# EAGLE design FTDI44 (EAGLE 8.0.2)
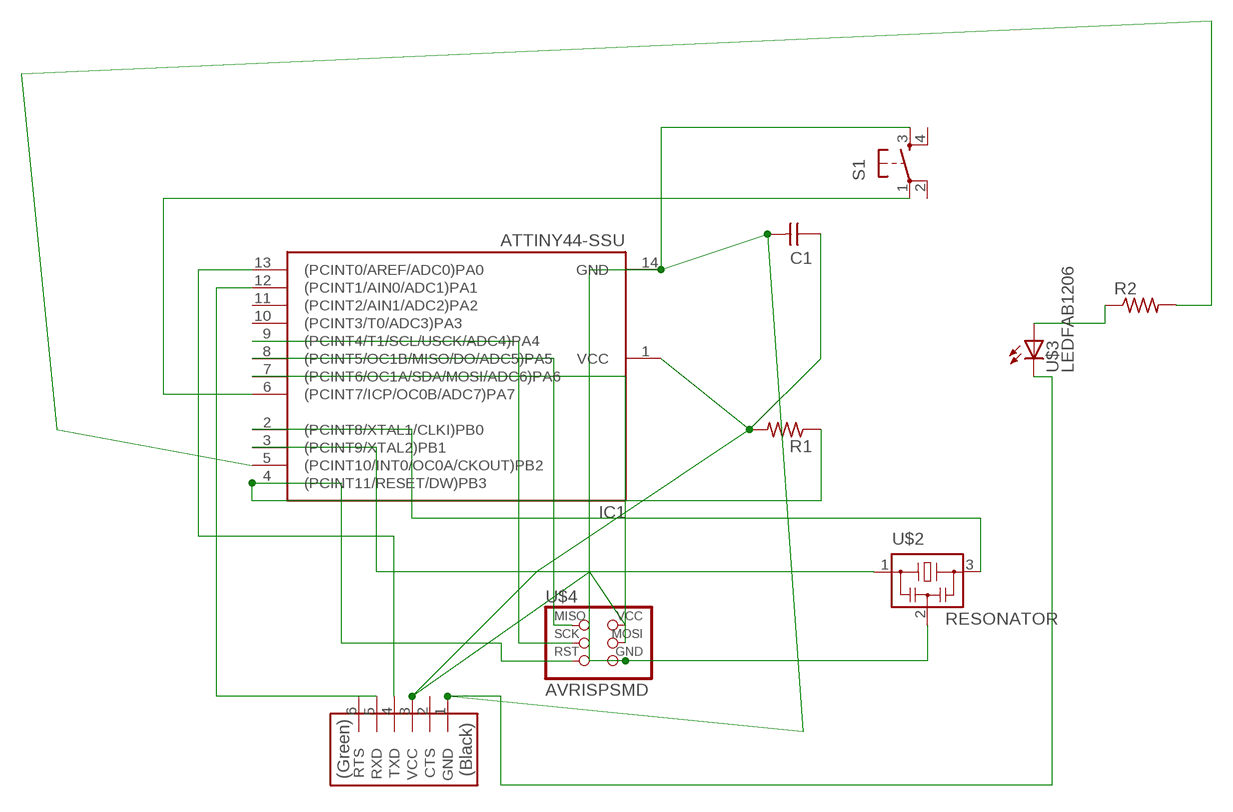
[diagram p0: schematic, sheet 1]

## Parts
C1  CAP-UNPOLARIZEDFAB  [C1206FAB]
IC1  ATTINY44-SSU  [SOIC14]
R1  RES-US1206FAB  [R1206FAB]
R2  RES-US1206FAB  [R1206FAB]
S1  6MM_SWITCH6MM_SWITCH  [6MM_SWITCH]
U$1  FTDI-SMD-HEADER  [1X06SMD]
U$2  RESONATOR  [EFOBM]
U$3  LEDFAB1206  [LED1206FAB]
U$4  AVRISPSMD  [2X03SMD]

## Nets
N$1: IC1.12((PCINT1/AIN0/ADC1)PA1) U$1.5(RXD)
N$2: C1.1 IC1.1(VCC) R1.2 U$1.3(VCC) U$4.2(VCC)
N$3: IC1.4((PCINT11/RESET/DW)PB3) R1.1 U$4.5(RST)
N$4: IC1.3((PCINT9/XTAL2)PB1) U$2.1
N$5: IC1.2((PCINT8/XTAL1/CLKI)PB0) U$2.3
N$6: C1.2 IC1.14(GND) S1.3(S) U$1.1(GND) U$2.2 U$3.2(C) U$4.6(GND)
N$7: IC1.13((PCINT0/AREF/ADC0)PA0) U$1.4(TXD)
N$8: IC1.8((PCINT5/OC1B/MISO/DO/ADC5)PA5) U$4.1(MISO)
N$9: IC1.7((PCINT6/OC1A/SDA/MOSI/ADC6)PA6) U$4.4(MOSI)
N$10: IC1.9((PCINT4/T1/SCL/USCK/ADC4)PA4) U$4.3(SCK)
N$11: R2.1 U$3.1(A)
N$12: IC1.6((PCINT7/ICP/OC0B/ADC7)PA7) S1.1(P)
N$13: IC1.5((PCINT10/INT0/OC0A/CKOUT)PB2) R2.2
Unconnected: IC1.10((PCINT3/T0/ADC3)PA3) IC1.11((PCINT2/AIN1/ADC2)PA2) S1.2(P1) S1.4(S1) U$1.2(CTS) U$1.6(RTS)

## Library data of the parts
C1 = fab:CAP-UNPOLARIZED
IC1 = fab:ATTINY44
R1 = fab:RES-US: Resistor (US Symbol) Variants with postfix FAB are widened to allow the routing of internal traces
R2 = 01_fab:RES-US: Resistor (US Symbol) Variants with postfix FAB are widened to allow the routing of internal traces
S1 = fab:6MM_SWITCH: OMRON SWITCH
U$1 = fab:FTDI-SMD-HEADER
U$2 = fab:RESONATOR
U$3 = fab:LED: LED
U$4 = fab:AVRISP

## Board
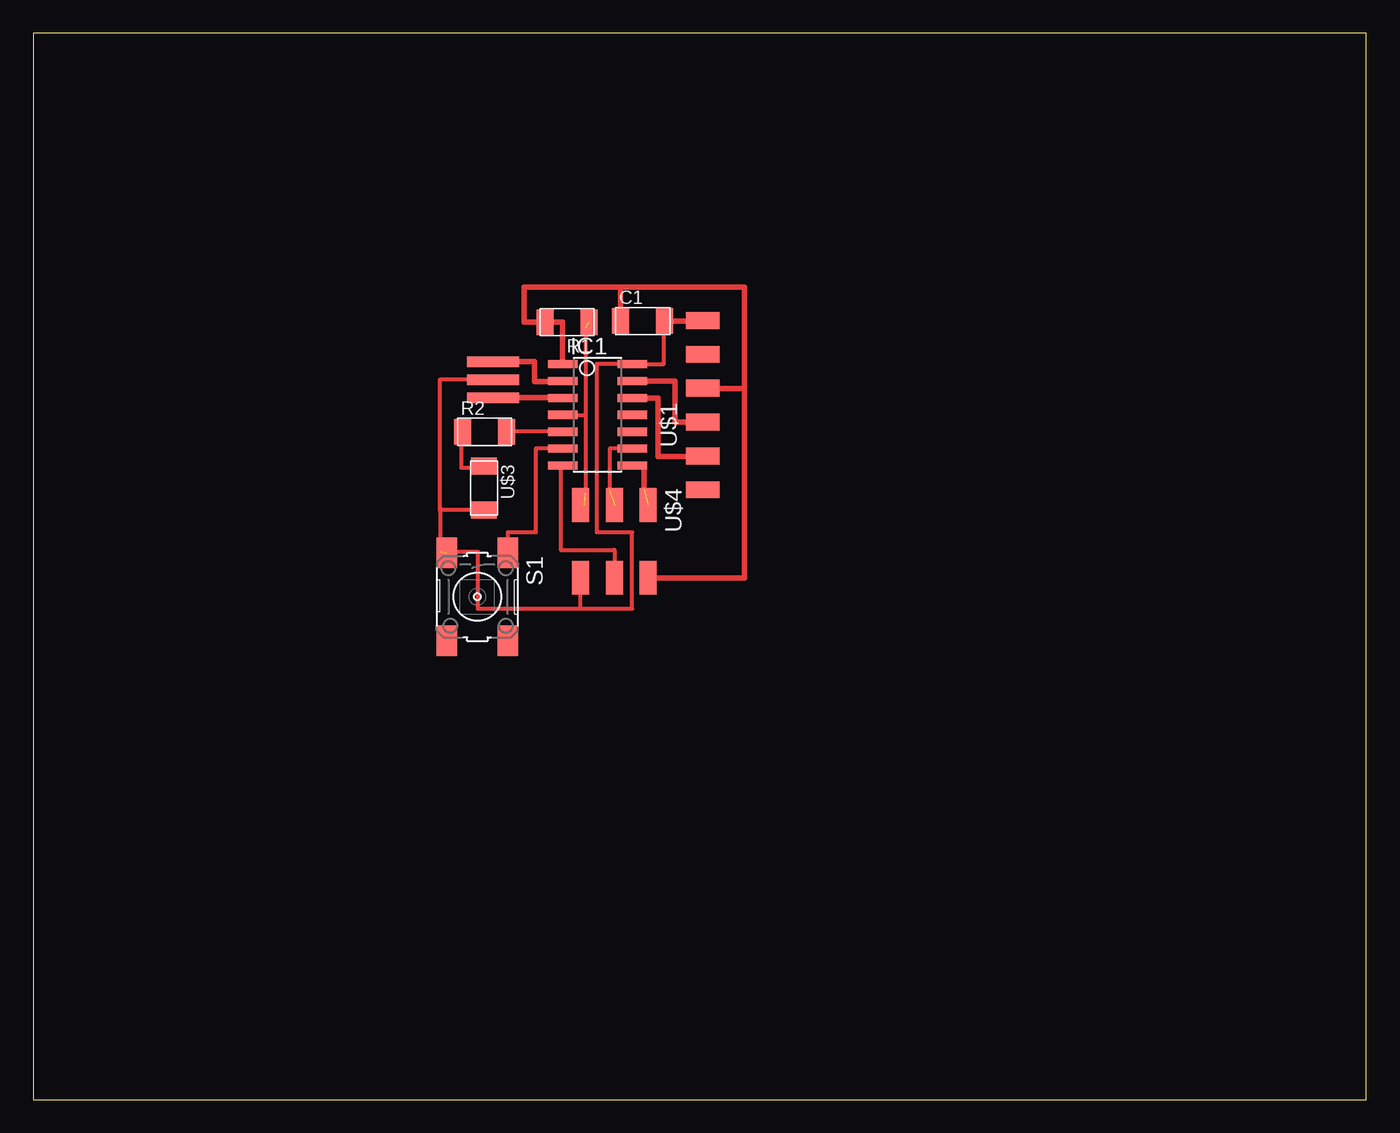
[diagram p1: board, top side]

Size 100 x 80 mm. Coordinates in mm from the lower left corner, seen from the top.
Outline: 0,0 100,0 100,80 0,80 0,0
Copper layers (1*16): Top 0.035mm / dielectric 1.5mm / Bottom 0.035mm
Design rules "default *": minimum track width 12mil, minimum drill 24mil, track to track 16mil, track to pad 16mil, pad to pad 16mil, via to via 16mil, smd to smd 16mil, copper to edge 40mil, drill to drill 8mil, minimum pad ring 10mil, minimum via ring 8mil, stop-mask expansion 4mil, vias tented up to drill 0mil, thermal gap 10mil

### Footprints (pad centres in the part's own frame; a part is rotated, then mirrored left to right if it is on the bottom)
C1206FAB = smd 1.27 x 1.905: 1 -1.651,0; 2 1.651,0
SOIC14 = smd 0.61 x 2.21: 1 -3.81,-2.603; 2 -2.54,-2.603; 3 -1.27,-2.603; 4 0,-2.603; 5 1.27,-2.603; 6 2.54,-2.603; 7 3.81,-2.603; 8 3.81,2.603; 9 2.54,2.603; 10 1.27,2.603; 11 0,2.603; 12 -1.27,2.603; 13 -2.54,2.603; 14 -3.81,2.603
R1206FAB = smd 1.27 x 1.905: 1 -1.651,0; 2 1.651,0
6MM_SWITCH = smd 2.286 x 1.524: 1 -3.302,2.286; 2 3.302,2.286; 3 -3.302,-2.286; 4 3.302,-2.286
1X06SMD = smd 2.54 x 1.27: 1 0,6.35; 2 0,3.81; 3 0,1.27; 4 0,-1.27; 5 0,-3.81; 6 0,-6.35
EFOBM = smd 0.8 x 3.9: 1 -1.35,0; 2 0,0; 3 1.35,0
LED1206FAB = smd 1.27 x 1.905: 1 -1.651,0; 2 1.651,0
2X03SMD = smd 2.54 x 1.27: 1 -2.54,2.54; 2 2.92,2.54; 3 -2.54,0; 4 2.92,0; 5 -2.54,-2.54; 6 2.92,-2.54

### Placement (x,y rotation side)
C1  45.72,58.42 0 top
IC1  42.32,51.37 270 top
R1  40.04,58.32 180 top
R2  33.85,50.1 0 top
S1  33.31,37.72 270 top
U$1  50.23,52.1 0 top
U$2  34.51,54.01 90 top
U$3  33.81,45.88 270 top
U$4  43.59,42.07 270 top

### Tracks (layer width: path | path; a pad name or v marks a point on that pad's centre or on a via)
N$1
  Top 0.406: IC1.12 46.86,52.64 46.86,48.26 50.23,48.26 U$1.5
N$2
  Top 0.406: 39.72,55.15 IC1.1 39.72,58.33 R1.2 36.83,58.33 36.83,60.96 44.07,60.96 | 44.07,60.96 C1.1 | 44.07,60.96 53.34,60.96 53.34,53.34 | 53.34,53.34 50.23,53.34 U$1.3 | U$4.2 53.34,39.15 53.34,53.34
N$3  (2 unrouted)
  Top 0.305: U$4.5 41.37,44.61 | 41.43,57.91 41.43,51.37 | IC1.4 41.43,51.37 | 41.43,51.37 41.43,45.5
  Top 0.406: 39.72,51.4 IC1.4
N$4
  Top 0.406: U$2.1 39.72,52.66 IC1.3
N$5
  Top 0.406: U$2.3 37.59,55.36 37.59,53.88 39.72,53.88 IC1.2
N$6  (1 unrouted)
  Top 0.305: 41.05,36.83 44.93,36.83 44.93,42.55 42.29,42.55 42.29,55.18 IC1.14 44.93,55.15 47.28,55.15 47.28,58.42 C1.2 | 41.05,36.83 U$4.6 | U$2.2 30.51,54.01 30.51,44.45 | 30.51,44.45 30.51,41.12 33.34,41.12 33.34,36.83 41.05,36.83 | U$3.2 30.51,44.23 30.51,44.45
  Top 0.406: C1.2 50.23,58.42 U$1.1
N$7
  Top 0.406: IC1.13 48.13,53.91 48.13,50.83 U$1.4
N$8  (1 unrouted)
  Top 0.406: IC1.8 45.81,47.56 45.81,45.75
N$9
  Top 0.305: IC1.7 39.56,47.56 39.56,41.24 43.59,41.24 U$4.4
N$10  (1 unrouted)
  Top 0.305: IC1.9 43.24,48.83 43.24,45.69
N$11
  Top 0.305: R2.1 32.1,50.1 32.1,47.4 33.81,47.4 U$3.1
N$12
  Top 0.305: IC1.6 37.69,48.83 37.69,42.55 35.59,42.55 S1.1
N$13
  Top 0.305: IC1.5 R2.2